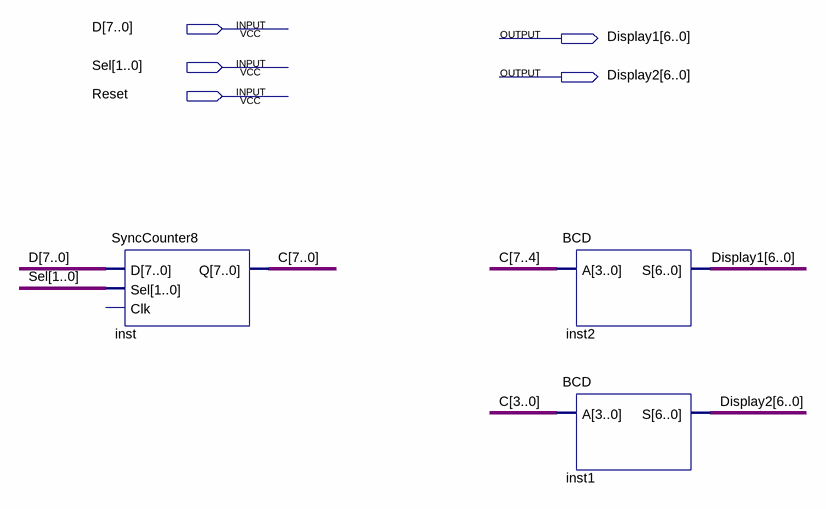
[diagram p0: schematic sheet]
// Quartus schematic CounterBCD.bdf as structural Verilog: 3 symbols, 5 pins
module CounterBCD (
  input  [7:0] D,
  input  [1:0] Sel,
  input  Reset,
  output [6:0] Display1,
  output [6:0] Display2
);

  wire [7:0] C;

  SyncCounter8 inst (.D(D), .Sel(Sel), .Q(C));  // open: Clk
  BCD inst2 (.A(C[7:4]), .S(Display1));
  BCD inst1 (.A(C[3:0]), .S(Display2));
endmodule
